# Altium schematic sheet IOTest.SchDoc
size A3; DocumentNumber: 5; SheetNumber: 5; SheetTotal: 5
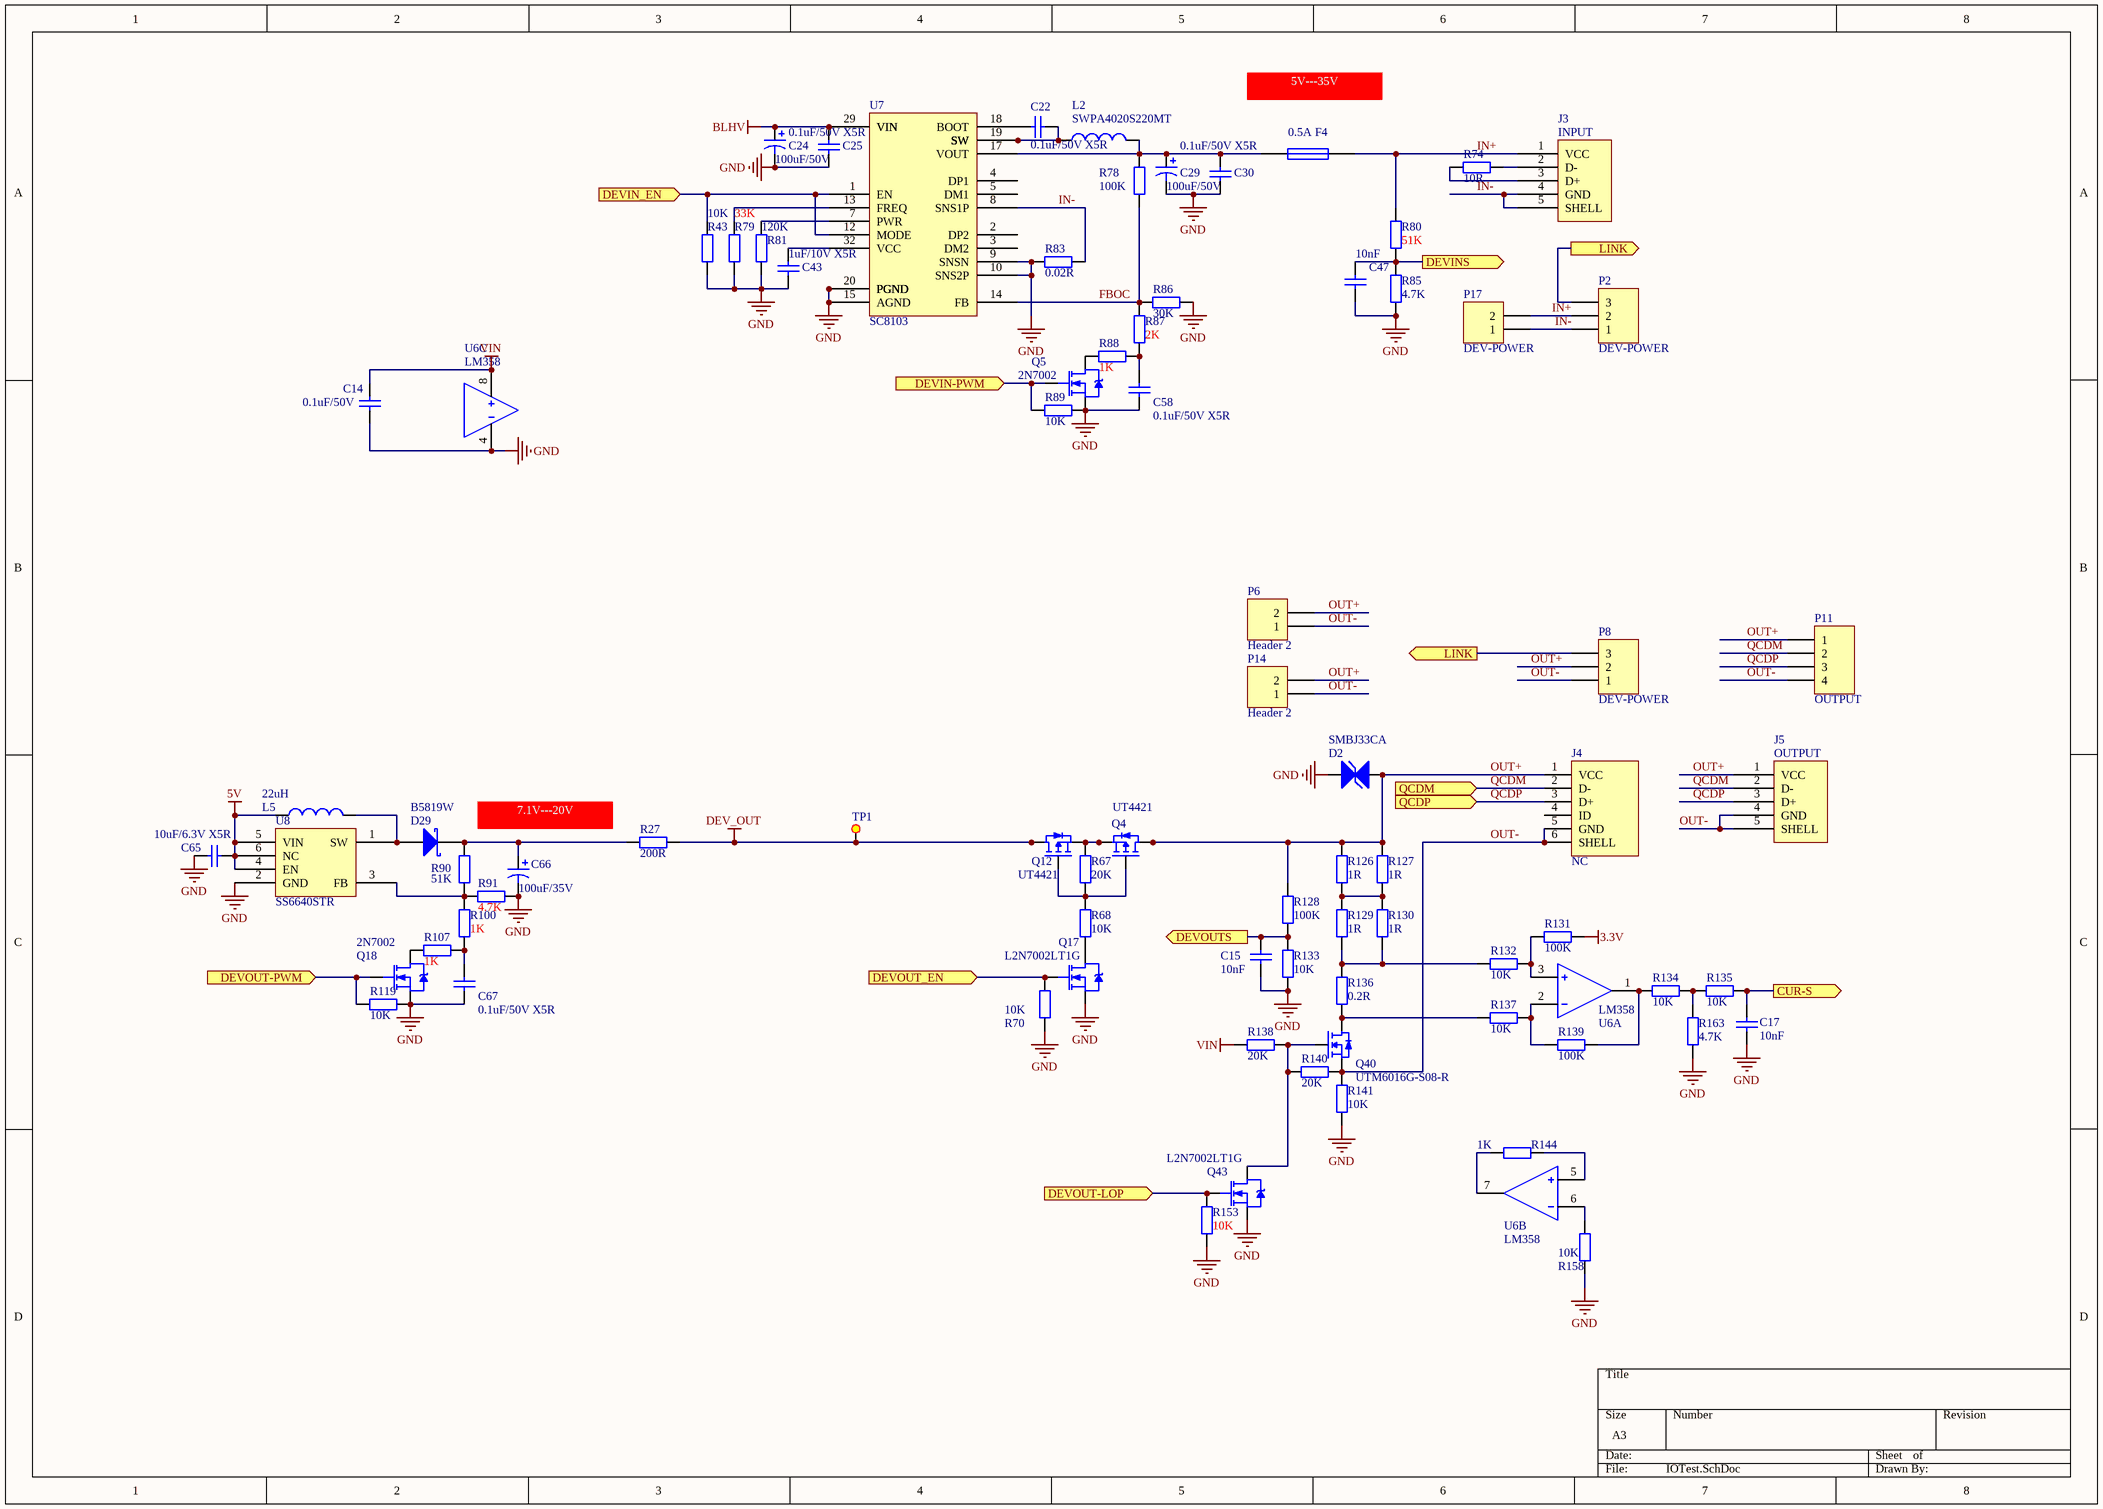
[diagram p0: IOTest.SchDoc]

## Parts
C14  0.1uF/50V  [C-0603]
C15  10nF  [C-0603]
C17  10nF  [C-0603]
C22  0.1uF/50V X5R  [C-0603]
C24  100uF/50V  [CAPPR-8x12]
C25  0.1uF/50V X5R  [C-0603]
C29  100uF/50V  [CAPPR-8x12]
C30  0.1uF/50V X5R  [C-0603]
C43  1uF/10V X5R  [C-0603]
C47  10nF  [C-0603]
C58  0.1uF/50V X5R  [C-0603]
C65  10uF/6.3V X5R  [C-0603]
C66  100uF/35V  [CAP-SMD-6.3x7.7]
C67  0.1uF/50V X5R  [C-0603]
D2  SMBJ33CA  [SMBJ]
D29  B5819W  [SOD-123FL]
F4  0.5A  [R-1206]
J3  INPUT  [ST-001-15A-1.0]
J4  NC  [ST-MICROUSB-03A]
J5  OUTPUT  [ST-001-15A-1.0]
L2  SWPA4020S220MT  [SWPA4020S]
L5  22uH  [DG3521]
P2  DEV-POWER  [XH 2.54-3P]
P6  Header 2  [XH 2.54-2P]
P8  DEV-POWER  [XH 2.54-3P]
P11  OUTPUT  [XH 2.54-4P]
P14  Header 2  [XH 2.54-2P]
P17  DEV-POWER  [XH 2.54-2P]
Q4  UT4421  [SOIC8]
Q5  2N7002  [SOT23-3]
Q12  UT4421  [SOIC8]
Q17  L2N7002LT1G  [SOT23-3]
Q18  2N7002  [SOT23-3]
Q40  UTM6016G-S08-R  [SOIC8]
Q43  L2N7002LT1G  [SOT23-3]
R27  200R  [R-0805]
R43  10K  [R-0603]
R67  20K  [R-0603]
R68  10K  [R-0603]
R70  10K  [R-0603]
R74  10R  [R-0603]
R78  100K  [R-0603]
R79  33K  [R-0603]
R80  51K  [R-0603]
R81  120K  [R-0603]
R83  0.02R  [R-2010]
R85  4.7K  [R-0603]
R86  30K  [R-0603]
R87  2K  [R-0603]
R88  1K  [R-0603]
R89  10K  [R-0603]
R90  51K  [R-0603]
R91  4.7K  [R-0603]
R100  1K  [R-0603]
R107  1K  [R-0603]
R119  10K  [R-0603]
R126  1R  [R-2512]
R127  1R  [R-2512]
R128  100K  [R-0603]
R129  1R  [R-2512]
R130  1R  [R-2512]
R131  100K  [R-0603]
R132  10K  [R-0603]
R133  10K  [R-0603]
R134  10K  [R-0603]
R135  10K  [R-0603]
R136  0.2R  [R-2512HP]
R137  10K  [R-0603]
R138  20K  [R-0603]
R139  100K  [R-0603]
R140  20K  [R-0603]
R141  10K  [R-0603]
R144  1K  [R-0603]
R153  10K  [R-0603]
R158  10K  [R-0603]
R163  4.7K  [R-0603]
TP1  (no value)  [TestPoint-1.5mm]
U6  LM358  [SOIC8]  (parts A,B,C of 3)
U7  SC8103  [SC8103]
U8  SS6640STR  [SOT23-6]

## Ports
CUR-S (out), DEVIN-PWM (in), DEVIN_EN (in), DEVINS (out), DEVOUT-LOP (in), DEVOUT-PWM (in), DEVOUT_EN (in), DEVOUTS (out), LINK (out), QCDM (in), QCDP (in)

## Nets
3.3V: R131.2
5V: C65.2 L5.1 U8.4(EN) U8.5(VIN) U8.6(NC)
BLHV: C24.1 C25.2 U7.29(VIN) U7.30(VIN) U7.31(VIN)
DEV_OUT: Q12.5(D) Q12.6(D) Q12.7(D) Q12.8(D) R27.2 TP1.1
GND: C14.2 C15.1 C17.1 C24.2 C25.1 C29.2 C30.1 C43.1 C47.1 C58.2 C65.1 C66.2 C67.2 D2.1 Q5.2(D) Q17.2(D) Q18.2(D) Q43.2(D) R43.1 R70.1 R79.1 R81.1 R83.1 R85.1 R86.1 R89.1 R91.2 R119.1 R133.1 R141.2 R153.2 R158.2 R163.1 U6.4 U7.9(SNSN) U7.10(SNS2P) U7.15(AGND) U7.20(PGND) U7.21(PGND) U7.22(PGND) U7.23(PGND) U7.24(PGND) U8.2(GND)
VIN: C14.1 R138.1 U6.8
CUR-S: C17.2 R135.2 ; port CUR-S
DEVIN-PWM: Q5.1(G) R89.2 ; port DEVIN-PWM
DEVIN_EN: R43.2 U7.1(EN) U7.12(MODE) ; port DEVIN_EN
DEVINS: C47.2 R80.1 R85.2 ; port DEVINS
DEVOUT-LOP: Q43.1(G) R153.1 ; port DEVOUT-LOP
DEVOUT-PWM: Q18.1(G) R119.2 ; port DEVOUT-PWM
DEVOUT_EN: Q17.1(G) R70.2 ; port DEVOUT_EN
DEVOUTS: C15.2 R128.1 R133.2 ; port DEVOUTS
FBOC: R78.2 R86.2 R87.2 U7.14(FB)
IN+: F4.2 J3.1(VCC) P2.2 P17.2 R80.2
IN-: J3.4(GND) J3.5(SHELL) P2.1 P17.1 R83.2 U7.8(SNS1P)
LINK: P2.3 P8.3 ; port LINK
OUT+: D2.2 J4.1(VCC) J5.1(VCC) P6.2 P8.2 P11.1 P14.2 Q4.5(D) Q4.6(D) Q4.7(D) Q4.8(D) R126.1 R127.2 R128.2
OUT-: J4.5(GND) J4.6(SHELL) J5.4(GND) J5.5(SHELL) P6.1 P8.1 P11.4 P14.1 Q40.1(S) Q40.2(S) Q40.3(S) R140.2 R141.1
QCDM: J4.2(D-) J5.2(D-) P11.2 ; port QCDM
QCDP: J4.3(D+) J5.3(D+) P11.3 ; port QCDP
NetC22_1: C22.1 L2.1 U7.16(SW) U7.19(SW) U7.25(SW) U7.26(SW) U7.27(SW) U7.28(SW)
NetC22_2: C22.2 U7.18(BOOT)
NetC29_1: C29.1 C30.2 F4.1 L2.2 R78.1 U7.17(VOUT)
NetC43_2: C43.2 U7.32(VCC)
NetC58_1: C58.1 R87.1 R88.1
NetC66_1: C66.1 D29.2(K) R27.1 R90.1
NetC67_1: C67.1 R100.1 R107.1
NetD29_1: D29.1(A) L5.2 U8.1(SW)
NetJ3_2: J3.2(D-) R74.1
NetJ3_3: J3.3(D+) R74.2
NetQ4_1: Q4.1(S) Q4.2(S) Q4.3(S) Q12.1(S) Q12.2(S) Q12.3(S) R67.2
NetQ4_4: Q4.4(G) Q12.4(G) R67.1 R68.2
NetQ5_3: Q5.3(S) R88.2
NetQ17_3: Q17.3(S) R68.1
NetQ18_3: Q18.3(S) R107.2
NetQ40_4: Q40.4(G) Q43.3(S) R138.2 R140.1
NetQ40_5: Q40.5(D) Q40.6(D) Q40.7(D) Q40.8(D) R136.1 R137.1
NetR79_2: R79.2 U7.13(FREQ)
NetR81_2: R81.2 U7.7(PWR)
NetR90_2: R90.2 R91.1 R100.2 U8.3(FB)
NetR126_2: R126.2 R127.1 R129.2 R130.1
NetR129_1: R129.1 R130.2 R132.1 R136.2
NetR131_1: R131.1 R132.2 U6.3
NetR134_1: R134.1 R139.2 U6.1
NetR134_2: R134.2 R135.1 R163.2
NetR137_2: R137.2 R139.1 U6.2
NetR144_1: R144.1 U6.5
NetR144_2: R144.2 U6.7
NetR158_1: R158.1 U6.6

Not connected (* = marked no-connect by the designer): J4 4(ID); U7 2(DP2) 3(DM2) 4(DP1) 5(DM1)

## Notes on the sheet
- 5V---35V
- 7.1V---20V

## Library data of the parts
C14 C15 C17 C22 C25 C30 C43 C47 C58 C65 C67 = Cap: Capacitor; Published: 8-Jun-2000; LatestRevisionDate: 17-Jul-2002; LatestRevisionNote: Re-released for DXP Platform.; PackageReference: RAD-0.3; Publisher: Altium Limited
  C14: Value: 0.1uF/50V
  C15 C17 C47: Value: 10nF
  C22 C25 C30 C58 C67: PackageDescription: Radial Cap, Thru-Hole; 2 Leads; 0.3 in Pin Spacing; Value: 0.1uF/50V X5R
  C43: PackageDescription: Radial Cap, Thru-Hole; 2 Leads; 0.3 in Pin Spacing; Value: 1uF/10V X5R
  C65: PackageDescription: Radial Cap, Thru-Hole; 2 Leads; 0.3 in Pin Spacing; Value: 10uF/6.3V X5R
C24 C29 C66 = Cap Pol1: Polarized Capacitor (Radial); Published: 8-Jun-2000; LatestRevisionDate: 17-Jul-2002; LatestRevisionNote: Re-released for DXP Platform.; PackageReference: RB7.6-15; Publisher: Altium Limited; PackageDescription: Polarized Capacitor (Radial); 2 Leads
  C24 C29: Value: 100uF/50V
  C66: Value: 100uF/35V
D2 = TVS-D
D29 = D Schottky: Schottky Diode; Published: 8-Jun-2000; LatestRevisionDate: 17-Jul-2002; LatestRevisionNote: Re-released for DXP Platform.; PackageReference: SMB; Publisher: Altium Limited; Code_JEDEC: DO-214-AA
F4 = Fuse 1: Fuse; Published: 8-Jun-2000; LatestRevisionDate: 17-Jul-2002; LatestRevisionNote: Re-released for DXP Platform.; PackageReference: PIN-W2/E2.8; Publisher: Altium Limited; PackageDescription: Thru-Hole; 2 Leads
J3 J5 = USB-CON: USB CONNECTOR
J4 = MICRO-USB-B
L2 L5 = Inductor: Code_IEC: 1005; Published: 8-Jun-2000; LatestRevisionDate: 29-May-2009; LatestRevisionNote: IPC-7351 Footprint Added.; PackageReference: 0402-A; Publisher: Altium Limited; PackageDescription: Chip Inductor; Code_JEITA: 0402
  L2: Value: SWPA4020S220MT
  L5: Value: 22uH
P2 P8 = Header 3: Header, 3-Pin; LatestRevisionDate: 17-Jul-2002; LatestRevisionNote: Re-released for DXP Platform.; Publisher: Altium Limited
P6 P14 P17 = Header 2: Header, 2-Pin; LatestRevisionDate: 17-Jul-2002; LatestRevisionNote: Re-released for DXP Platform.; Publisher: Altium Limited
P11 = Header 4: Header, 4-Pin; LatestRevisionDate: 17-Jul-2002; LatestRevisionNote: Re-released for DXP Platform.; Publisher: Altium Limited
Q4 Q12 = SO8-PMOS
Q5 Q17 Q18 Q43 = NMOS-2: N-Channel Power MOSFET; Note: Pin 2 is electrically connected to pin 4.; Published: 8-Jun-2000; LatestRevisionDate: 17-Jul-2002; LatestRevisionNote: Re-released for DXP Platform.; DatasheetVersion: PD-9.814; PackageVersion: Feb-1997; PackageReference: TO-220AB; Publisher: Altium Limited; PackageDescription: TO, Thru-Hole, Vertical, Heatsink Mounted; 3 In-Line Leads; Pitch 2.54 mm; ComponentLink1Description: Manufacturer Link; ComponentLink1URL: http://www.irf.com/
Q40 = SO8-NMOS
R27 R43 R67 R68 R70 R74 R78-R81 R83 R85-R91 R100 R107 R119 R126-R141 R144 R153 R158 R163 = Res2: Resistor; Published: 8-Jun-2000; LatestRevisionDate: 17-Jul-2002; LatestRevisionNote: Re-released for DXP Platform.; PackageReference: AXIAL-0.4; Publisher: Altium Limited
  R27: Value: 200R
  R43 R68 R70 R89 R119 R132-R135 R137 R141 R153 R158: Value: 10K
  R67 R138 R140: Value: 20K
  R74: Value: 10R
  R78 R128 R131 R139: Value: 100K
  R79: Value: 33K
  R80 R90: Value: 51K
  R81: Value: 120K
  R83: Value: 0.02R
  R85 R91 R163: Value: 4.7K
  R86: Value: 30K
  R87: Value: 2K
  R88 R100 R107 R144: Value: 1K
  R126 R127 R129 R130: Value: 1R
  R136: Value: 0.2R
TP1 = TEST_P
U6 = Dual_OPAMP
U8 = AX5523